# EAGLE schematic final_pcb (EAGLE 8.2.2)
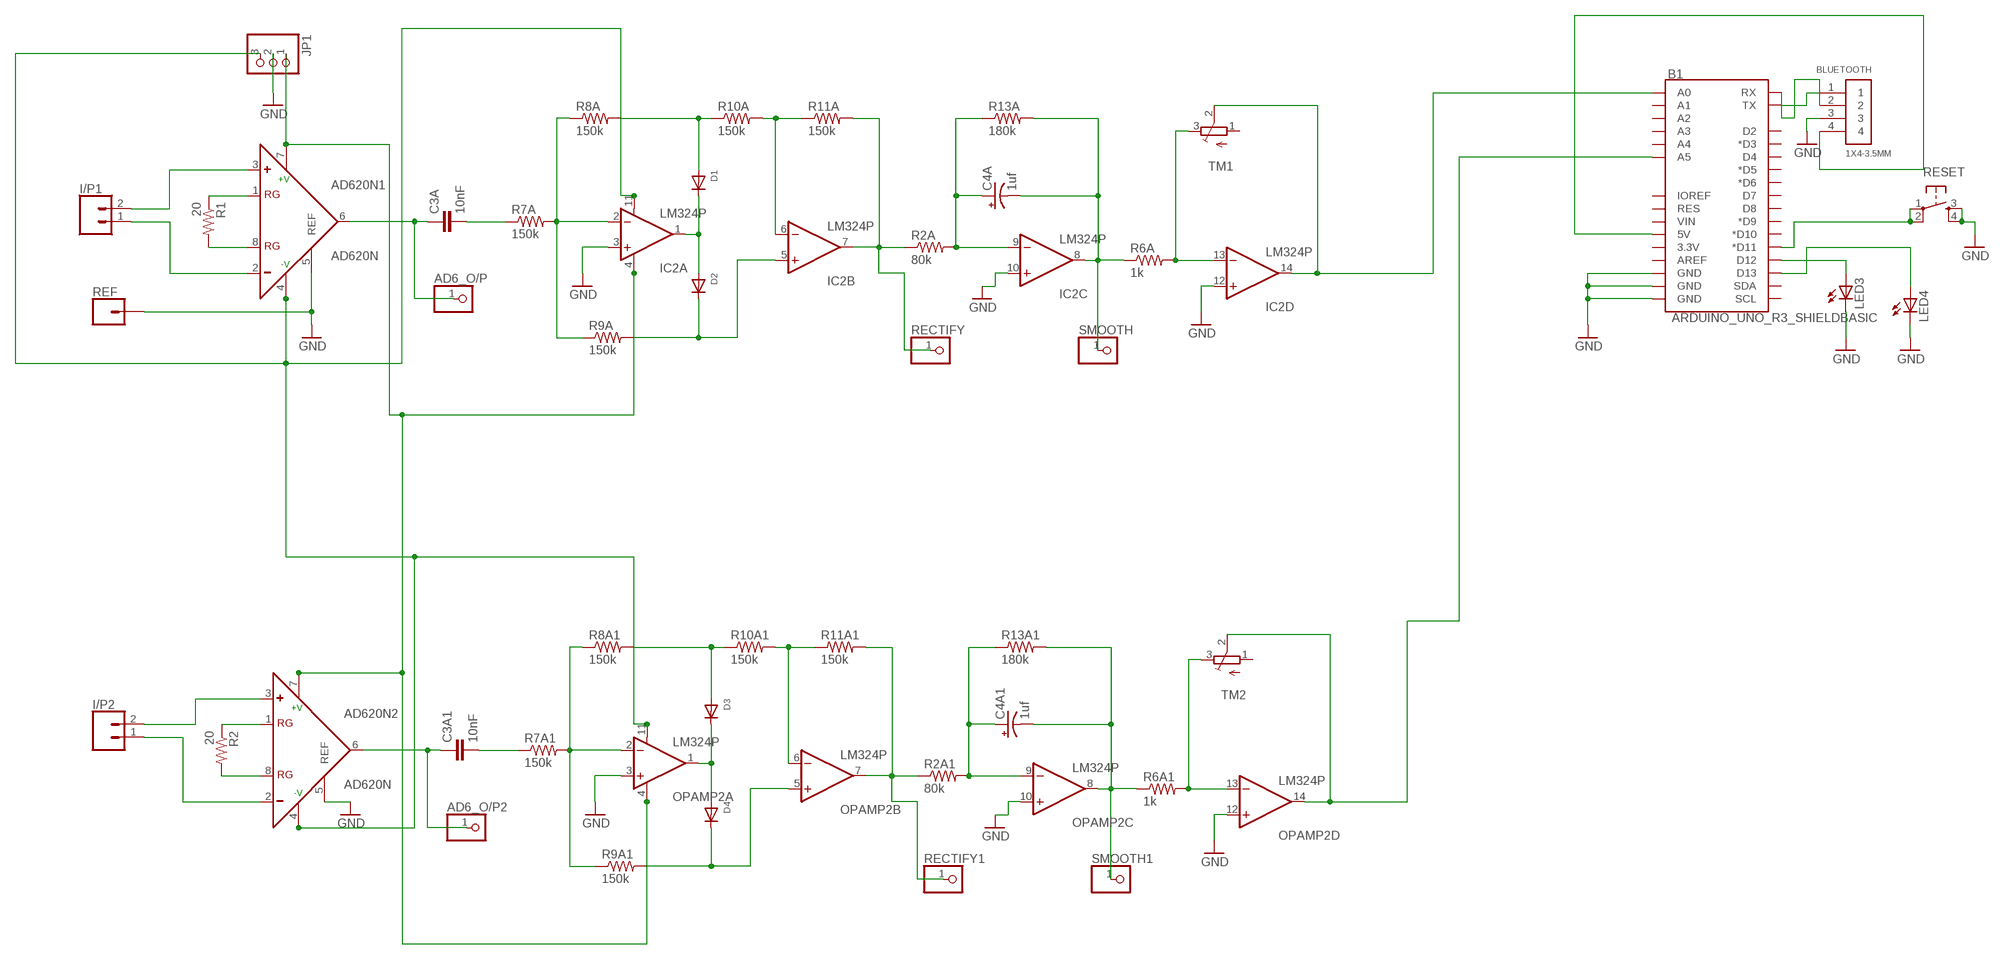
[diagram p0: schematic, sheet 1]

## Parts
AD6_O/P  PINHD-1X1  [1X01]
AD6_O/P2  PINHD-1X1  [1X01]
AD620N1  AD620N  [DIL08]
AD620N2  AD620N  [DIL08]
B1  ARDUINO_UNO_R3_SHIELDBASIC  [UNO_R3_SHIELD]
BLUETOOTH  1X4-3.5MM  [1X04-3.5MM]
C3A  10nF  10NF-PTH-10MM-10000V-1-%  [CAP-PTH-10MM]
C3A1  10nF  10NF-PTH-10MM-10000V-1-%  [CAP-PTH-10MM]
C4A  1uf  1000UF-RADIAL-5MM-35V-20%-KIT  [CPOL-RADIAL-5MM-10MM-KIT]
C4A1  1uf  1000UF-RADIAL-5MM-35V-20%-KIT  [CPOL-RADIAL-5MM-10MM-KIT]
D1  DIODEDO-1N4148  [DO-1N4148]
D2  DIODEDO-1N4148  [DO-1N4148]
D3  DIODEDO-1N4148  [DO-1N4148]
D4  DIODEDO-1N4148  [DO-1N4148]
I/P1  CONN_02  [1X02]
I/P2  CONN_02  [1X02]
IC2  LM324P  [DIL14]
JP1  PINHD-1X3  [1X03]
LED3  LED5MM  [LED5MM]
LED4  LED5MM  [LED5MM]
OPAMP2  LM324P  [DIL14]
R1  20  R-US_0207/9  [0207/9]
R2  20  R-US_0207/9  [0207/9]
R2A  80k  R-US_0207/9  [0207/9]
R2A1  80k  R-US_0207/9  [0207/9]
R6A  1k  R-US_0207/9  [0207/9]
R6A1  1k  R-US_0207/9  [0207/9]
R7A  150k  R-US_0207/9  [0207/9]
R7A1  150k  R-US_0207/9  [0207/9]
R8A  150k  R-US_0207/9  [0207/9]
R8A1  150k  R-US_0207/9  [0207/9]
R9A  150k  R-US_0207/9  [0207/9]
R9A1  150k  R-US_0207/9  [0207/9]
R10A  150k  R-US_0207/9  [0207/9]
R10A1  150k  R-US_0207/9  [0207/9]
R11A  150k  R-US_0207/9  [0207/9]
R11A1  150k  R-US_0207/9  [0207/9]
R13A  180k  R-US_0207/9  [0207/9]
R13A1  180k  R-US_0207/9  [0207/9]
RECTIFY  PINHD-1X1  [1X01]
RECTIFY1  PINHD-1X1  [1X01]
REF  CONN_01  [1X01]
RESET  TAC_SWITCHPTH  [TACTILE-PTH]
SMOOTH  PINHD-1X1  [1X01]
SMOOTH1  PINHD-1X1  [1X01]
TM1  TRIMPOT3386  [TRIM-3386]
TM2  TRIMPOT3386  [TRIM-3386]

## Nets
GND: AD620N1.5(REF) AD620N2.5(REF) B1.GND@0(GND) B1.GND@1(GND) B1.GND@2(GND) BLUETOOTH.3 IC2.3(A:+IN) IC2.10(C:+IN) IC2.12(D:+IN) JP1.2 LED3.K(C) LED4.K(C) OPAMP2.3(A:+IN) OPAMP2.10(C:+IN) OPAMP2.12(D:+IN) REF.1 RESET.3 RESET.4
N$1: AD620N1.7(+V) AD620N2.7(+V) IC2.4(A:V+) JP1.1 OPAMP2.4(A:V+)
N$3: AD620N1.2(-) I/P1.1
N$4: AD620N1.3(+) I/P1.2
N$5: AD620N1.1(RG) R1.1
N$6: AD620N1.8(RG) R1.2
N$7: AD6_O/P.1 AD620N1.6(OUT) C3A.1
N$8: C3A.2 R7A.1
N$9: IC2.2(A:-IN) R7A.2 R8A.1 R9A.1
N$10: D1.A R8A.2 R10A.1
N$11: D1.C D2.A IC2.1(A:OUT)
N$12: IC2.7(B:OUT) R2A.1 R11A.2 RECTIFY.1
N$13: IC2.6(B:-IN) R10A.2 R11A.1
N$15: C4A.+ IC2.9(C:-IN) R2A.2 R13A.1
N$16: C4A.- IC2.8(C:OUT) R6A.1 R13A.2 SMOOTH.1
N$17: IC2.13(D:-IN) R6A.2 TM1.3(E)
N$18: B1.A0 IC2.14(D:OUT) TM1.2(S)
N$19: AD620N1.4(-V) AD620N2.4(-V) IC2.11(A:V-) JP1.3 OPAMP2.11(A:V-)
N$21: AD620N2.1(RG) R2.1
N$22: AD620N2.8(RG) R2.2
N$23: AD6_O/P2.1 AD620N2.6(OUT) C3A1.1
N$24: C3A1.2 R7A1.1
N$25: OPAMP2.2(A:-IN) R7A1.2 R8A1.1 R9A1.1
N$26: D3.A R8A1.2 R10A1.1
N$27: D3.C D4.A OPAMP2.1(A:OUT)
N$28: OPAMP2.7(B:OUT) R2A1.1 R11A1.2 RECTIFY1.1
N$29: OPAMP2.6(B:-IN) R10A1.2 R11A1.1
N$30: C4A1.+ OPAMP2.9(C:-IN) R2A1.2 R13A1.1
N$31: C4A1.- OPAMP2.8(C:OUT) R6A1.1 R13A1.2 SMOOTH1.1
N$32: OPAMP2.13(D:-IN) R6A1.2 TM2.3(E)
N$34: AD620N2.3(+) I/P2.2
N$35: B1.TX BLUETOOTH.1
N$36: B1.RX BLUETOOTH.2
N$37: B1.D11(*D11) RESET.1 RESET.2
N$38: B1.5V BLUETOOTH.4
N$39: B1.D12 LED3.A
N$40: B1.D13 LED4.A
N$41: D2.C IC2.5(B:+IN) R9A.2
N$42: B1.A5 OPAMP2.14(D:OUT) TM2.2(S)
N$44: D4.C OPAMP2.5(B:+IN) R9A1.2
N$50: AD620N2.2(-) I/P2.1
Unconnected: B1.3.3V B1.A1 B1.A2 B1.A3 B1.A4 B1.AREF B1.D2 B1.D3(*D3) B1.D4 B1.D5(*D5) B1.D6(*D6) B1.D7 B1.D8 B1.D9(*D9) B1.D10(*D10) B1.IOREF B1.RES B1.SCL B1.SDA B1.VIN TM1.1(A) TM2.1(A)

## Library data of the parts
AD6_O/P AD6_O/P2 RECTIFY RECTIFY1 SMOOTH SMOOTH1 = adafruit:PINHD-1X1: Pin header 1x1 for 0.1" spacing With round pins
AD620N1 AD620N2 = analog-devices:AD620: Low Cost, Low Power, Instrumentation Amplifier Source: http://www.analog.com/UploadedFiles/Data_Sheets/37793330023930AD620_e.pdf; MF: ALTERA CORPORATION; MPN: AD620AN; OC_FARNELL: 1523782; OC_NEWARK: 05F7108
B1 = SparkFun-Boards:ARDUINO_UNO_R3_SHIELD: Arduino R3 Shield Footprint Shield form compatible with the Arduino Uno R3. SparkFun Products: MG2639 Cellular Shield <https://www.sparkfun.com/products/13120> MIDI Shield <https://www.sparkfun.com/products/12898> R3 Stackable Headers Kit <https://www.sparkfun.com/products/11417>
BLUETOOTH = adafruit:1X4: 4-pin connector
C3A C3A1 = SparkFun-Capacitors:10NF: 0.01uF/10nF/10,000pF ceramic capacitors A capacitor is a passive two-terminal electrical component used to store electrical energy temporarily in an electric field. CAP-09321; PROD_ID: CAP-09321
C4A C4A1 = SparkFun-Capacitors:1000UF: 1,000µF/1mF ceramic capacitors A capacitor is a passive two-terminal electrical component used to store electrical energy temporarily in an electric field. CAP-08070; PROD_ID: CAP-09538; VALUE: 1mf
D1-D4 = adafruit:DIODE: Diode SMADIODE - SMA Surface Mount Package 20V 1A Schottky Diode Digikey: 641-1014-6-ND DO-1N4148 - Through Hole Small Current Diode SOD-123 20V 1 A (.5mV Vf) Schottky Diode - Digikey: MBRX120TPMSCT-ND SOD-323 10V 570mA (.38mV Vf, 3ns) Schottky Diode - Digikey: ZLLS410CT-ND SOD-523 30V 30mA Schottky Diode (RB751S-40TE61) - Digikey: RB751S-40TE61CT-ND SOT23-R/W - SOT23 Package (R = Solder Paste/Reflow Ovens, W = Hand-Soldering) BAT54Film 40V 300mA - Digikey: 497-7162-1-ND
I/P1 I/P2 = SparkFun-Connectors:CONN_02: Multi connection point. Often used as Generic Header-pin footprint for 0.1 inch spaced/style header connections On any of the 0.1 inch spaced packages, you can populate with these: Break Away Headers - Straight <https://www.sparkfun.com/products/116> (PRT-00116) Break Away Male Headers - Right Angle <https://www.sparkfun.com/products/553> (PRT-00553) Female Headers <https://www.sparkfun.com/products/115> (PRT-00115) Break Away Headers - Machine Pin <https://www.sparkfun.com/products/117> (PRT-00117) Break Away Female Headers - Swiss Machine Pin <https://www.sparkfun.com/products/743> (PRT-00743) For SCREWTERMINALS and SPRING TERMINALS visit here: Screw Terimnals on SparkFun.com <https://www.sparkfun.com/search/results?term=Screw+Terminals> (5mm/3.5mm/2.54mm spacing) This device is also useful as a general connection point to wire up your design to another part of your project. Our various solder wires solder well into these plated through hole pads. Hook-Up Wire - Assortment (Stranded, 22 AWG) <https://www.sparkfun.com/products/11375> (PRT-11375) Hook-Up Wire - Assortment (Solid Core, 22 AWG) <https://www.sparkfun.com/products/11367> (PRT-11367) View the entire wire category on our website here <https://www.sparkfun.com/categories/141> Special notes: Molex polarized connector foot print use with: PRT-08233 with associated crimp pins and housings. 2.54_SCREWTERM for use with PRT-10571. 3.5mm Screw Terminal footprints for PRT-08084 5mm Screw Terminal footprints for use with PRT-08432
IC2 OPAMP2 = lm324:LM324: Low Power, Precision FET-Input Operational Amplifiers
JP1 = adafruit:PINHD-1X3: PIN HEADER
LED3 LED4 = adafruit:LED: LED OSRAM: - CHIPLED LG R971, LG N971, LY N971, LG Q971, LY Q971, LO R971, LY R971 LH N974, LH R974 LS Q976, LO Q976, LY Q976 LO Q996 - Hyper CHIPLED LW Q18S LB Q993, LB Q99A, LB R99A - SideLED LS A670, LO A670, LY A670, LG A670, LP A670 LB A673, LV A673, LT A673, LW A673 LH A674 LY A675 LS A676, LA A676, LO A676, LY A676, LW A676 LS A679, LY A679, LG A679 - Hyper Micro SIDELED® LS Y876, LA Y876, LO Y876, LY Y876 LT Y87S - SmartLED LW L88C, LW L88S LB L89C, LB L89S, LG L890 LS L89K, LO L89K, LY L89K LS L896, LA L896, LO L896, LY L896 - TOPLED LS T670, LO T670, LY T670, LG T670, LP T670 LSG T670, LSP T670, LSY T670, LOP T670, LYG T670 LG T671, LOG T671, LSG T671 LB T673, LV T673, LT T673, LW T673 LH T674 LS T676, LA T676, LO T676, LY T676, LB T676, LH T676, LSB T676, LW T676 LB T67C, LV T67C, LT T67C, LS T67K, LO T67K, LY T67K, LW E67C LS E67B, LA E67B, LO E67B, LY E67B, LB E67C, LV E67C, LT E67C LW T67C LS T679, LY T679, LG T679 LS T770, LO T770, LY T770, LG T770, LP T770 LB T773, LV T773, LT T773, LW T773 LH T774 LS E675, LA E675, LY E675, LS T675 LS T776, LA T776, LO T776, LY T776, LB T776 LHGB T686 LT T68C, LB T68C - Hyper Mini TOPLED® LB M676 - Mini TOPLED Santana® LG M470 LS M47K, LO M47K, LY M47K Source: http://www.osram.convergy.de/
R1 R2 R2A R2A1 R6A R6A1 R7A R7A1 R8A R8A1 R9A R9A1 R10A R10A1 R11A R11A1 R13A R13A1 = adafruit:R-US_: RESISTOR, American symbol
REF = SparkFun-Connectors:CONN_01: Single connection point. Often used as Generic Header-pin footprint for 0.1 inch spaced/style header connections On any of the 0.1 inch spaced packages, you can populate with these: Break Away Headers - Straight <https://www.sparkfun.com/products/116> (PRT-00116) Break Away Male Headers - Right Angle <https://www.sparkfun.com/products/553> (PRT-00553) Female Headers <https://www.sparkfun.com/products/115> (PRT-00115) Break Away Headers - Machine Pin <https://www.sparkfun.com/products/117> (PRT-00117) Break Away Female Headers - Swiss Machine Pin <https://www.sparkfun.com/products/743> (PRT-00743) This device is also useful as a general connection point to wire up your design to another part of your project. Our various solder wires solder well into these plated through hole pads. Hook-Up Wire - Assortment (Stranded, 22 AWG) <https://www.sparkfun.com/products/11375> (PRT-11375) Hook-Up Wire - Assortment (Solid Core, 22 AWG) <https://www.sparkfun.com/products/11367> (PRT-11367) View the entire wire category on our website here <https://www.sparkfun.com/categories/141> Special notes: SMTSO-256-ET is a "flush mount" nut for a 4-40 screw. We mostly use this on specialty testbeds; it is a nice way to connect hardware to your PCB at an adjustable hieght. Also note, the SNAP packages are for using a snappable style connector. We sell a baggie of snaps and they are also used on two LilyPad designs: Snap Assortment - 30 pack (male and female) <https://www.sparkfun.com/products/11347> (DEV-11347) LilyPad Arduino SimpleSnap <https://www.sparkfun.com/products/10941> (DEV-10941) LilyPad SimpleSnap Protoboard <https://www.sparkfun.com/products/10940> (DEV-10940)
RESET = SparkFun-Retired:TAC_SWITCH: Momentary Switch Button commonly used for reset or general input. Spark Fun Electronics SKU : COM-00097 SMT- SWCH-08247
TM1 TM2 = adafruit:TRIMPOT: SMT trimmer potentiometer part number TC33X http://www.ladyada.net/library/eagle

## Net classes
0 default: width 0.305 mm, drill 0.051 mm, clearance 0.051 mm